# Altium project TOP.PrjPcb
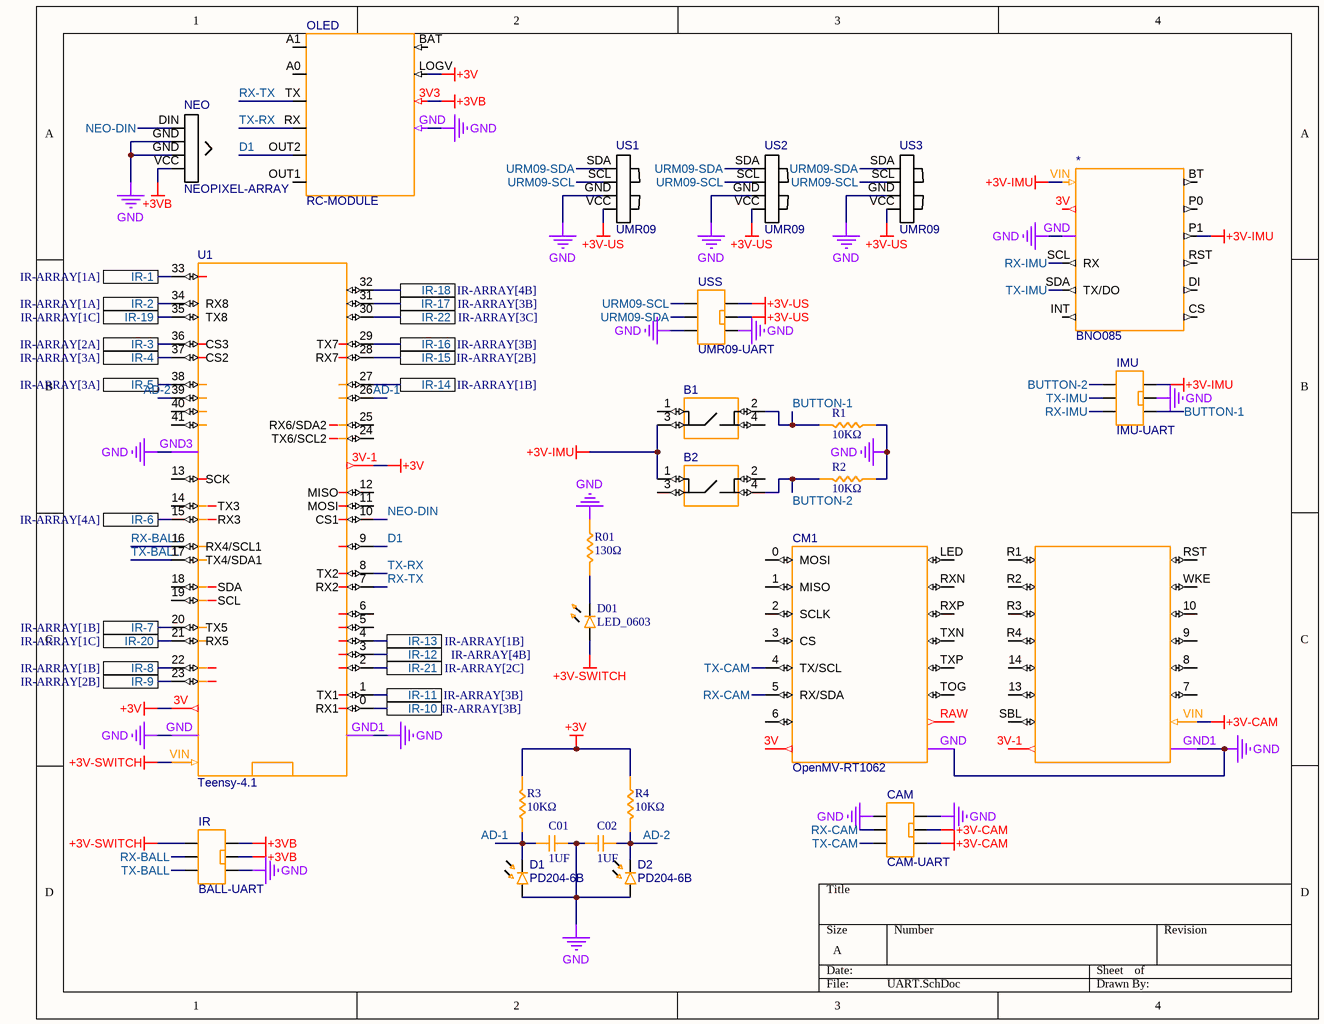
[diagram p0: UART.SchDoc]
2 sheets, 68 parts. Net scope: flat (ports and power ports of the same name join across sheets).
Board file: TOP.PcbDoc
Sheets:
  UART.SchDoc
  IR-ARRAY.SchDoc

## Sheet UART.SchDoc
size A; SheetNumber: 1; SheetTotal: 2

### Parts
*  BNO085  [BNO085]
B1  BUTTON  [BUTTON]  (value not drawn)
B2  BUTTON  [BUTTON]  (value not drawn)
C01  1UF  [CAP_0603]
C02  1UF  [CAP_0603]
CAM  CAM-UART  [IDC-6PIN-SMT-2.54]
CM1  OpenMV-RT1062  [OpenMV-RT1062]
D1  PD204-6B  [PD204-6B]
D01  LED_0603  [LED_0603]
D2  PD204-6B  [PD204-6B]
IMU  IMU-UART  [IDC-6PIN-SMT-2.54]
IR  BALL-UART  [IDC-6PIN-SMT-2.54]
NEO  NEOPIXEL-ARRAY  [NEOPIXEL-ARRAY]
OLED  RC-MODULE  [RC-MODULE]
R1  10KΩ  [RES_0603]
R01  130Ω  [RES_0603]
R2  10KΩ  [RES_0603]
R3  10KΩ  [RES_0603]
R4  10KΩ  [RES_0603]
U1  Teensy-4.1  [Teensy-4.1]
US1  UMR09  [URM09]
US2  UMR09  [URM09]
US3  UMR09  [URM09]
USS  UMR09-UART  [IDC-6PIN-SMT-2.54]

### Ports
IR-1 (see IR-ARRAY[1A]), IR-2 (see IR-ARRAY[1A]), IR-3 (see IR-ARRAY[2A]), IR-4 (see IR-ARRAY[3A]), IR-5 (see IR-ARRAY[3A]), IR-6 (see IR-ARRAY[4A]), IR-7 (see IR-ARRAY[1B]), IR-8 (see IR-ARRAY[1B]), IR-9 (see IR-ARRAY[2B]), IR-10 (see IR-ARRAY[3B]), IR-11 (see IR-ARRAY[3B]), IR-12 (see IR-ARRAY[4B]), IR-13 (see IR-ARRAY[1B]), IR-14 (see IR-ARRAY[1B]), IR-15 (see IR-ARRAY[2B]), IR-16 (see IR-ARRAY[3B]), IR-17 (see IR-ARRAY[3B]), IR-18 (see IR-ARRAY[4B]), IR-19 (see IR-ARRAY[1C]), IR-20 (see IR-ARRAY[1C]), IR-21 (see IR-ARRAY[2C]), IR-22 (see IR-ARRAY[3C])

### Nets
+3V: OLED.LOGV R3.1 R4.2 U1.3V U1.3V-1
+3V-CAM: CAM.4 CAM.5 CM1.VIN
+3V-IMU: *.P1 *.VIN B1.3 B2.1 IMU.6
+3V-SWITCH: D01.A IR.1 U1.VIN
+3V-US: US1.VCC US2.VCC US3.VCC USS.5 USS.6
+3VB: IR.5 IR.6 NEO.VCC OLED.3V3
GND: *.GND C01.1 C02.1 CAM.1 CAM.6 CM1.GND CM1.GND1 D1.A D2.A IMU.5 IR.4 NEO.GND OLED.GND R1.2 R01.2 R2.2 U1.GND U1.GND1 U1.GND3 US1.GND US2.GND US3.GND USS.3 USS.4
AD-1: C01.2 D1.C R3.2 U1.26
AD-2: C02.2 D2.C R4.1 U1.39
BUTTON-1: B1.2 IMU.4 R1.1
BUTTON-2: B2.4 IMU.1 R2.1
D1: OLED.OUT2 U1.9
NEO-DIN: NEO.DIN U1.10(CS1)
RX-BALL: IR.2 U1.16(RX4/SCL1)
RX-CAM: CAM.2 CM1.5(RX/SDA)
RX-IMU: *.SCL(RX) IMU.3
RX-TX: OLED.TX U1.7(RX2)
TX-BALL: IR.3 U1.17(TX4/SDA1)
TX-CAM: CAM.3 CM1.4(TX/SCL)
TX-IMU: *.SDA(TX/DO) IMU.2
TX-RX: OLED.RX U1.8(TX2)
URM09-SCL: US1.SCL US2.SCL US3.SCL USS.1
URM09-SDA: US1.SDA US2.SDA US3.SDA USS.2
NetD01_C: D01.C R01.1
NetIR1_OUT: U1.33 ; port IR-1
NetIR2_OUT: U1.34(RX8) ; port IR-2
NetIR3_OUT: U1.36(CS3) ; port IR-3
NetIR4_OUT: U1.37(CS2) ; port IR-4
NetIR5_OUT: U1.38 ; port IR-5
NetIR6_OUT: U1.15(RX3) ; port IR-6
NetIR7_OUT: U1.20(TX5) ; port IR-7
NetIR8_OUT: U1.22 ; port IR-8
NetIR9_OUT: U1.23 ; port IR-9
NetIR10_OUT: U1.0(RX1) ; port IR-10
NetIR11_OUT: U1.1(TX1) ; port IR-11
NetIR12_OUT: U1.3 ; port IR-12
NetIR13_OUT: U1.4 ; port IR-13
NetIR14_OUT: U1.27 ; port IR-14
NetIR15_OUT: U1.28(RX7) ; port IR-15
NetIR16_OUT: U1.29(TX7) ; port IR-16
NetIR17_OUT: U1.31 ; port IR-17
NetIR18_OUT: U1.32 ; port IR-18
NetIR19_OUT: U1.35(TX8) ; port IR-19
NetIR20_OUT: U1.21(RX5) ; port IR-20
NetIR21_OUT: U1.2 ; port IR-21
NetIR22_OUT: U1.30 ; port IR-22

Not connected (* = marked no-connect by the designer): * 3V BT CS DI INT P0 RST; B1 1 4; B2 2 3; CM1 0(MOSI) 1(MISO) 2(SCLK) 3(CS) 3V 3V-1 6 7 8 9 10 13 14 LED R1 R2 R3 R4 RAW RST RXN RXP SBL TOG TXN TXP WKE; OLED A0 A1 BAT OUT1; U1 5 6 11(MOSI) 12(MISO) 13(SCK) 14(TX3) 18(SDA) 19(SCL) 24(TX6/SCL2) 25(RX6/SDA2) 40 41

### Library data of the parts
C01 C02 = CAP_0603: Capacitor SMD 0603 generic
CAM IMU IR USS = IDC-6PIN-SMT-2.54_1_1
R1 R01-R4 = RES_0603: Resistor SMD 0603 generic

## Sheet IR-ARRAY.SchDoc
size A; SheetNumber: 2; SheetTotal: 2
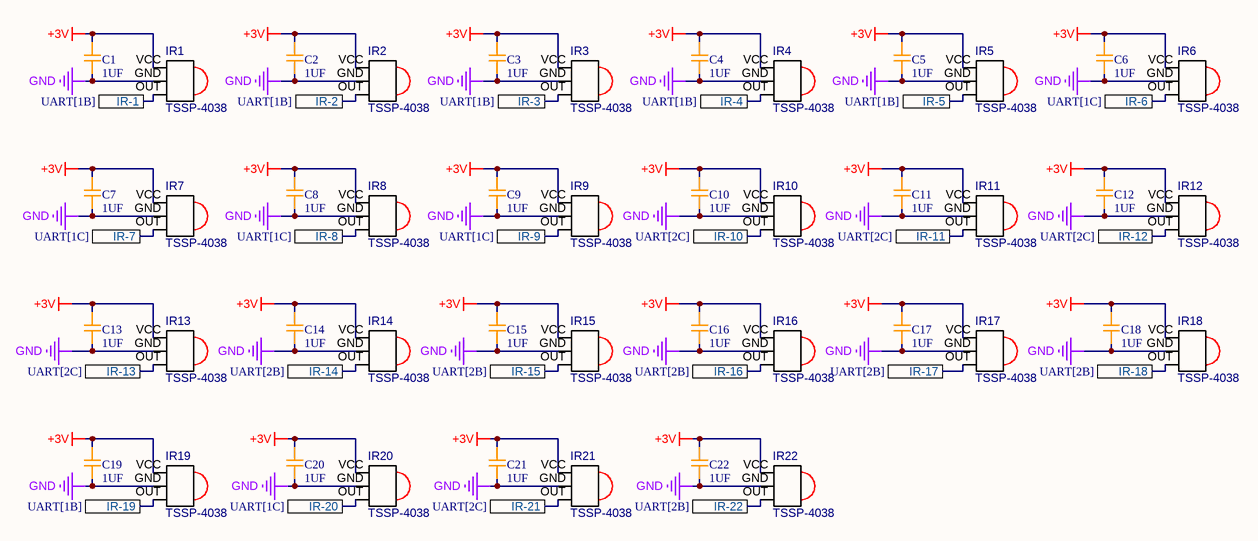
[diagram p1: IR-ARRAY.SchDoc]

### Parts
C1  1UF  [CAP_0603]
C2  1UF  [CAP_0603]
C3  1UF  [CAP_0603]
C4  1UF  [CAP_0603]
C5  1UF  [CAP_0603]
C6  1UF  [CAP_0603]
C7  1UF  [CAP_0603]
C8  1UF  [CAP_0603]
C9  1UF  [CAP_0603]
C10  1UF  [CAP_0603]
C11  1UF  [CAP_0603]
C12  1UF  [CAP_0603]
C13  1UF  [CAP_0603]
C14  1UF  [CAP_0603]
C15  1UF  [CAP_0603]
C16  1UF  [CAP_0603]
C17  1UF  [CAP_0603]
C18  1UF  [CAP_0603]
C19  1UF  [CAP_0603]
C20  1UF  [CAP_0603]
C21  1UF  [CAP_0603]
C22  1UF  [CAP_0603]
IR1  TSSP-4038  [TSSP-4038]
IR2  TSSP-4038  [TSSP-4038]
IR3  TSSP-4038  [TSSP-4038]
IR4  TSSP-4038  [TSSP-4038]
IR5  TSSP-4038  [TSSP-4038]
IR6  TSSP-4038  [TSSP-4038]
IR7  TSSP-4038  [TSSP-4038]
IR8  TSSP-4038  [TSSP-4038]
IR9  TSSP-4038  [TSSP-4038]
IR10  TSSP-4038  [TSSP-4038]
IR11  TSSP-4038  [TSSP-4038]
IR12  TSSP-4038  [TSSP-4038]
IR13  TSSP-4038  [TSSP-4038]
IR14  TSSP-4038  [TSSP-4038]
IR15  TSSP-4038  [TSSP-4038]
IR16  TSSP-4038  [TSSP-4038]
IR17  TSSP-4038  [TSSP-4038]
IR18  TSSP-4038  [TSSP-4038]
IR19  TSSP-4038  [TSSP-4038]
IR20  TSSP-4038  [TSSP-4038]
IR21  TSSP-4038  [TSSP-4038]
IR22  TSSP-4038  [TSSP-4038]

### Ports
IR-1 (see UART[1B]), IR-2 (see UART[1B]), IR-3 (see UART[1B]), IR-4 (see UART[1B]), IR-5 (see UART[1B]), IR-6 (see UART[1C]), IR-7 (see UART[1C]), IR-8 (see UART[1C]), IR-9 (see UART[1C]), IR-10 (see UART[2C]), IR-11 (see UART[2C]), IR-12 (see UART[2C]), IR-13 (see UART[2C]), IR-14 (see UART[2B]), IR-15 (see UART[2B]), IR-16 (see UART[2B]), IR-17 (see UART[2B]), IR-18 (see UART[2B]), IR-19 (see UART[1B]), IR-20 (see UART[1C]), IR-21 (see UART[2C]), IR-22 (see UART[2B])

### Nets
+3V: C1.1 C2.1 C3.1 C4.1 C5.1 C6.1 C7.1 C8.1 C9.1 C10.1 C11.1 C12.1 C13.1 C14.1 C15.1 C16.1 C17.1 C18.1 C19.1 C20.1 C21.1 C22.1 IR1.VCC IR2.VCC IR3.VCC IR4.VCC IR5.VCC IR6.VCC IR7.VCC IR8.VCC IR9.VCC IR10.VCC IR11.VCC IR12.VCC IR13.VCC IR14.VCC IR15.VCC IR16.VCC IR17.VCC IR18.VCC IR19.VCC IR20.VCC IR21.VCC IR22.VCC
GND: C1.2 C2.2 C3.2 C4.2 C5.2 C6.2 C7.2 C8.2 C9.2 C10.2 C11.2 C12.2 C13.2 C14.2 C15.2 C16.2 C17.2 C18.2 C19.2 C20.2 C21.2 C22.2 IR1.GND IR2.GND IR3.GND IR4.GND IR5.GND IR6.GND IR7.GND IR8.GND IR9.GND IR10.GND IR11.GND IR12.GND IR13.GND IR14.GND IR15.GND IR16.GND IR17.GND IR18.GND IR19.GND IR20.GND IR21.GND IR22.GND
NetIR1_OUT: IR1.OUT ; port IR-1
NetIR2_OUT: IR2.OUT ; port IR-2
NetIR3_OUT: IR3.OUT ; port IR-3
NetIR4_OUT: IR4.OUT ; port IR-4
NetIR5_OUT: IR5.OUT ; port IR-5
NetIR6_OUT: IR6.OUT ; port IR-6
NetIR7_OUT: IR7.OUT ; port IR-7
NetIR8_OUT: IR8.OUT ; port IR-8
NetIR9_OUT: IR9.OUT ; port IR-9
NetIR10_OUT: IR10.OUT ; port IR-10
NetIR11_OUT: IR11.OUT ; port IR-11
NetIR12_OUT: IR12.OUT ; port IR-12
NetIR13_OUT: IR13.OUT ; port IR-13
NetIR14_OUT: IR14.OUT ; port IR-14
NetIR15_OUT: IR15.OUT ; port IR-15
NetIR16_OUT: IR16.OUT ; port IR-16
NetIR17_OUT: IR17.OUT ; port IR-17
NetIR18_OUT: IR18.OUT ; port IR-18
NetIR19_OUT: IR19.OUT ; port IR-19
NetIR20_OUT: IR20.OUT ; port IR-20
NetIR21_OUT: IR21.OUT ; port IR-21
NetIR22_OUT: IR22.OUT ; port IR-22

### Library data of the parts
C1-C22 = CAP_0603: Capacitor SMD 0603 generic

## Nets that join several sheets
+3V: UART (5 pins), IR-ARRAY (44 pins)
GND: UART (24 pins), IR-ARRAY (44 pins)
NetIR1_OUT: UART (U1.33), IR-ARRAY (IR1.OUT)
NetIR2_OUT: UART (U1.34), IR-ARRAY (IR2.OUT)
NetIR3_OUT: UART (U1.36), IR-ARRAY (IR3.OUT)
NetIR4_OUT: UART (U1.37), IR-ARRAY (IR4.OUT)
NetIR5_OUT: UART (U1.38), IR-ARRAY (IR5.OUT)
NetIR6_OUT: UART (U1.15), IR-ARRAY (IR6.OUT)
NetIR7_OUT: UART (U1.20), IR-ARRAY (IR7.OUT)
NetIR8_OUT: UART (U1.22), IR-ARRAY (IR8.OUT)
NetIR9_OUT: UART (U1.23), IR-ARRAY (IR9.OUT)
NetIR10_OUT: UART (U1.0), IR-ARRAY (IR10.OUT)
NetIR11_OUT: UART (U1.1), IR-ARRAY (IR11.OUT)
NetIR12_OUT: UART (U1.3), IR-ARRAY (IR12.OUT)
NetIR13_OUT: UART (U1.4), IR-ARRAY (IR13.OUT)
NetIR14_OUT: UART (U1.27), IR-ARRAY (IR14.OUT)
NetIR15_OUT: UART (U1.28), IR-ARRAY (IR15.OUT)
NetIR16_OUT: UART (U1.29), IR-ARRAY (IR16.OUT)
NetIR17_OUT: UART (U1.31), IR-ARRAY (IR17.OUT)
NetIR18_OUT: UART (U1.32), IR-ARRAY (IR18.OUT)
NetIR19_OUT: UART (U1.35), IR-ARRAY (IR19.OUT)
NetIR20_OUT: UART (U1.21), IR-ARRAY (IR20.OUT)
NetIR21_OUT: UART (U1.2), IR-ARRAY (IR21.OUT)
NetIR22_OUT: UART (U1.30), IR-ARRAY (IR22.OUT)